# Altium schematic sheet DAP-MCU-3.SchDoc
size D; SheetNumber: 3; SheetTotal: 4
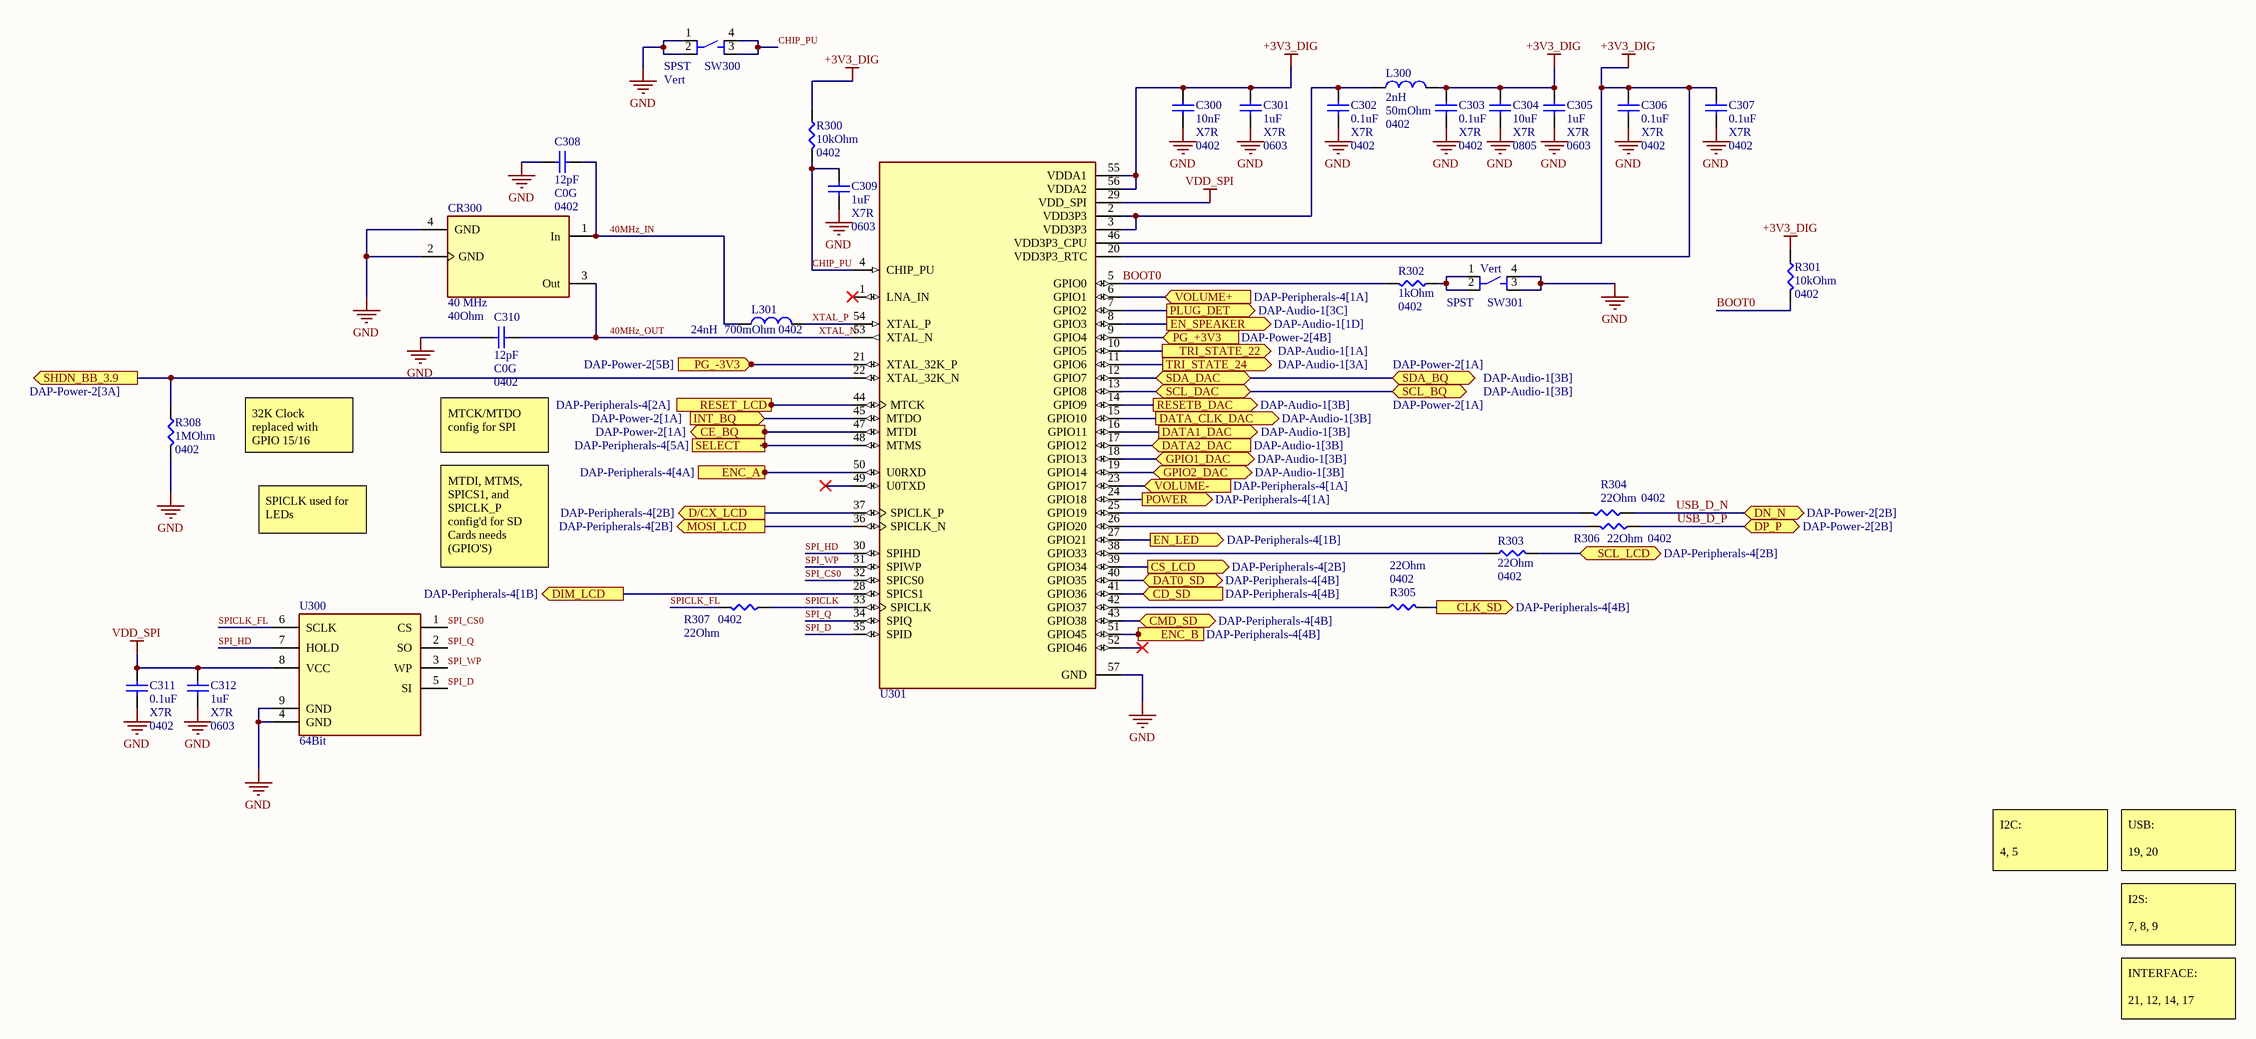
[diagram p0: DAP-MCU-3.SchDoc]

## Parts
C300  <Value>: 10nF  <Spec>: X7R  <Footprint>: 0402  [CAPC1005X55N]  (hidden comment: CAP CER 10000PF 16V X7R 0402)
C301  <Value>: 1uF  <Spec>: X7R  <Footprint>: 0603  [CAPC1608X100N]  (hidden comment: CAP CER 1UF 25V X7R 0603)
C302  <Value>: 0.1uF  <Spec>: X7R  <Footprint>: 0402  [CAPC1005X60N]  (hidden comment: CAP CER 0.1UF 50V X7R 0402)
C303  <Value>: 0.1uF  <Spec>: X7R  <Footprint>: 0402  [CAPC1005X60N]  (hidden comment: CAP CER 0.1UF 50V X7R 0402)
C304  <Value>: 10uF  <Spec>: X7R  <Footprint>: 0805  [CAPC2012X140N]  (hidden comment: CAP CER 10UF 10V X7R 0805)
C305  <Value>: 1uF  <Spec>: X7R  <Footprint>: 0603  [CAPC1608X100N]  (hidden comment: CAP CER 1UF 25V X7R 0603)
C306  <Value>: 0.1uF  <Spec>: X7R  <Footprint>: 0402  [CAPC1005X60N]  (hidden comment: CAP CER 0.1UF 50V X7R 0402)
C307  <Value>: 0.1uF  <Spec>: X7R  <Footprint>: 0402  [CAPC1005X60N]  (hidden comment: CAP CER 0.1UF 50V X7R 0402)
C308  <Value>: 12pF  <Spec>: C0G  <Footprint>: 0402  [CAPC1005X60N]  (hidden comment: CAP CER 12PF 50V C0G/NP0 0402)
C309  <Value>: 1uF  <Spec>: X7R  <Footprint>: 0603  [CAPC1608X100N]  (hidden comment: CAP CER 1UF 25V X7R 0603)
C310  <Value>: 12pF  <Spec>: C0G  <Footprint>: 0402  [CAPC1005X60N]  (hidden comment: CAP CER 12PF 50V C0G/NP0 0402)
C311  <Value>: 0.1uF  <Spec>: X7R  <Footprint>: 0402  [CAPC1005X60N]  (hidden comment: CAP CER 0.1UF 50V X7R 0402)
C312  <Value>: 1uF  <Spec>: X7R  <Footprint>: 0603  [CAPC1608X100N]  (hidden comment: CAP CER 1UF 25V X7R 0603)
CR300  <Value>: 40 MHz  <Spec>: 40Ohm  [CRYST_ECS-400]  (hidden comment: CRYSTAL 40.0000MHZ 10PF SMD)
L300  <Value>: 2nH  <Spec>: 50mOhm  <Footprint>: 0402  [IND_MHQ100507]  (hidden comment: FIXED IND 2NH 1A 50 MOHM SMD)
L301  <Value>: 24nH  <Spec>: 700mOhm  <Footprint>: 0402  [IND_MHQ100507]  (hidden comment: FIXED IND 24NH 250MA 700 MOHM)
R300  <Value>: 10kOhm  <Footprint>: 0402  [RESC1005X40N]  (hidden comment: RES SMD 10K OHM 1% 1/16W 0402)
R301  <Value>: 10kOhm  <Footprint>: 0402  [RESC1005X40N]  (hidden comment: RES SMD 10K OHM 1% 1/16W 0402)
R302  <Value>: 1kOhm  <Footprint>: 0402  [RESC1005X40N]  (hidden comment: RES SMD 1K OHM 0.1% 1/16W 0402)
R303  <Value>: 22Ohm  <Footprint>: 0402  [RESC1005X40N]  (hidden comment: RES 22 OHM 1% 1/16W 0402)
R304  <Value>: 22Ohm  <Footprint>: 0402  [RESC1005X40N]  (hidden comment: RES 22 OHM 1% 1/16W 0402)
R305  <Value>: 22Ohm  <Footprint>: 0402  [RESC1005X40N]  (hidden comment: RES 22 OHM 1% 1/16W 0402)
R306  <Value>: 22Ohm  <Footprint>: 0402  [RESC1005X40N]  (hidden comment: RES 22 OHM 1% 1/16W 0402)
R307  <Value>: 22Ohm  <Footprint>: 0402  [RESC1005X40N]  (hidden comment: RES 22 OHM 1% 1/16W 0402)
R308  <Value>: 1MOhm  <Footprint>: 0402  [RESC1005X40N]  (hidden comment: RES SMD 1M OHM 0.1% 1/16W 0402)
SW300  <Value>: SPST  <Footprint>: Vert  [SW_PTS810_SJM_250_SMTR_LFS]  (hidden comment: SWITCH TACTILE SPST-NO 0.05A 16V)
SW301  <Value>: SPST  <Footprint>: Vert  [SW_PTS810_SJM_250_SMTR_LFS]  (hidden comment: SWITCH TACTILE SPST-NO 0.05A 16V)
U300  <Value>: 64Bit  [SON127P600X500X80-9N]  (hidden comment: IC FLASH 64MBIT SPI/QUAD 8WSON)
U301  ESP32-S3  [IC_ESP32-S3]  (value not drawn)

## Ports
CD_SD (in, see DAP-Peripherals-4[4B]), CE_BQ (out, see DAP-Power-2[1A]), CLK_SD (out, see DAP-Peripherals-4[4B]), CMD_SD (bidir, see DAP-Peripherals-4[4B]), CS_LCD (out, see DAP-Peripherals-4[2B]), D/CX_LCD (out, see DAP-Peripherals-4[2B]), DAT0_SD (bidir, see DAP-Peripherals-4[4B]), DATA1_DAC (out, see DAP-Audio-1[3B]), DATA2_DAC (in, see DAP-Audio-1[3B]), DATA_CLK_DAC (out, see DAP-Audio-1[3B]), DIM_LCD (out, see DAP-Peripherals-4[1B]), DN_N (bidir, see DAP-Power-2[2B]), DP_P (bidir, see DAP-Power-2[2B]), EN_LED (out, see DAP-Peripherals-4[1B]), EN_SPEAKER (out, see DAP-Audio-1[1D]), ENC_A (in, see DAP-Peripherals-4[4A]), ENC_B (in, see DAP-Peripherals-4[4B]), GPIO1_DAC (bidir, see DAP-Audio-1[3B]), GPIO2_DAC (bidir, see DAP-Audio-1[3B]), INT_BQ (in, see DAP-Power-2[1A]), MOSI_LCD (out, see DAP-Peripherals-4[2B]), PG_+3V3 (in, see DAP-Power-2[4B]), PG_-3V3 (in, see DAP-Power-2[5B]), PLUG_DET (out, see DAP-Audio-1[3C]), POWER (out, see DAP-Peripherals-4[1A]), RESET_LCD (out, see DAP-Peripherals-4[2A]), RESETB_DAC (out, see DAP-Audio-1[3B]), SCL_BQ (bidir, see DAP-Power-2[1A]), SCL_DAC (bidir, see DAP-Audio-1[3B]), SCL_LCD (bidir, see DAP-Peripherals-4[2B]), SDA_BQ (bidir, see DAP-Power-2[1A]), SDA_DAC (bidir, see DAP-Audio-1[3B]), SELECT (in, see DAP-Peripherals-4[5A]), SHDN_BB_3.9 (out, see DAP-Power-2[3A]), TRI_STATE_22 (out, see DAP-Audio-1[1A]), TRI_STATE_24 (out, see DAP-Audio-1[3A]), VOLUME+ (in, see DAP-Peripherals-4[1A]), VOLUME- (in, see DAP-Peripherals-4[1A])

## Nets
+3V3_DIG: C300.2 C301.2 C303.2 C304.2 C305.2 C306.2 C307.2 L300.2 R300.2 R301.2 U301.20(VDD3P3_RTC) U301.46(VDD3P3_CPU) U301.55(VDDA1) U301.56(VDDA2)
GND: C300.1 C301.1 C302.1 C303.1 C304.1 C305.1 C306.1 C307.1 C308.2 C309.1 C310.2 C311.1 C312.1 CR300.2(GND) CR300.4(GND) R308.1 SW300.1 SW300.2 SW301.3 SW301.4 U300.4(GND) U300.9(GND) U301.57(GND)
VDD_SPI: C311.2 C312.2 U300.8(VCC) U301.29(VDD_SPI)
40MHz_IN: C308.1 CR300.1(In) L301.1
40MHz_OUT: C310.1 CR300.3(Out) U301.53(XTAL_N)  [also labelled XTAL_N]
BOOT0: R301.1 R302.1 U301.5(GPIO0)
CD_SD: U301.41(GPIO36) ; port CD_SD
CE_BQ: U301.47(MTDI) ; port CE_BQ
CHIP_PU: C309.2 R300.1 SW300.3 SW300.4 U301.4(CHIP_PU)
CLK_SD: R305.1 ; port CLK_SD
CMD_SD: U301.43(GPIO38) ; port CMD_SD
CS_LCD: U301.39(GPIO34) ; port CS_LCD
D/CX_LCD: U301.37(SPICLK_P) ; port D/CX_LCD
DAT0_SD: U301.40(GPIO35) ; port DAT0_SD
DATA1_DAC: U301.16(GPIO11) ; port DATA1_DAC
DATA2_DAC: U301.17(GPIO12) ; port DATA2_DAC
DATA_CLK_DAC: U301.15(GPIO10) ; port DATA_CLK_DAC
DIM_LCD: U301.28(SPICS1) ; port DIM_LCD
EN_LED: U301.27(GPIO21) ; port EN_LED
EN_SPEAKER: U301.8(GPIO3) ; port EN_SPEAKER
ENC_A: U301.50(U0RXD) ; port ENC_A
ENC_B: U301.51(GPIO45) ; port ENC_B
GPIO1_DAC: U301.18(GPIO13) ; port GPIO1_DAC
GPIO2_DAC: U301.19(GPIO14) ; port GPIO2_DAC
INT_BQ: U301.45(MTDO) ; port INT_BQ
MOSI_LCD: U301.36(SPICLK_N) ; port MOSI_LCD
PG_+3V3: U301.9(GPIO4) ; port PG_+3V3
PG_-3V3: U301.21(XTAL_32K_P) ; port PG_-3V3
PLUG_DET: U301.7(GPIO2) ; port PLUG_DET
POWER: U301.24(GPIO18) ; port POWER
RESET_LCD: U301.44(MTCK) ; port RESET_LCD
RESETB_DAC: U301.14(GPIO9) ; port RESETB_DAC
SCL_BQ: U301.13(GPIO8) ; port SCL_DAC, port SCL_BQ
SCL_LCD: R303.1 ; port SCL_LCD
SDA_BQ: U301.12(GPIO7) ; port SDA_DAC, port SDA_BQ
SELECT: U301.48(MTMS) ; port SELECT
SHDN_BB_3.9: R308.2 U301.22(XTAL_32K_N) ; port SHDN_BB_3.9
SPI_CS0: U300.1(CS) U301.32(SPICS0)
SPI_D: U300.5(SI) U301.35(SPID)
SPI_HD: U300.7(HOLD) U301.30(SPIHD)
SPI_Q: U300.2(SO) U301.34(SPIQ)
SPI_WP: U300.3(WP) U301.31(SPIWP)
SPICLK: R307.2 U301.33(SPICLK)
SPICLK_FL: R307.1 U300.6(SCLK)
TRI_STATE_22: U301.10(GPIO5) ; port TRI_STATE_22
TRI_STATE_24: U301.11(GPIO6) ; port TRI_STATE_24
USB_D_N: R304.2 ; port DN_N
USB_D_P: R306.2 ; port DP_P
VOLUME+: U301.6(GPIO1) ; port VOLUME+
VOLUME-: U301.23(GPIO17) ; port VOLUME-
XTAL_P: L301.2 U301.54(XTAL_P)
NetC302_2: C302.2 L300.1 U301.2(VDD3P3) U301.3(VDD3P3)
NetR302_2: R302.2 SW301.1 SW301.2
NetR303_2: R303.2 U301.38(GPIO33)
NetR304_1: R304.1 U301.25(GPIO19)
NetR305_2: R305.2 U301.42(GPIO37)
NetR306_1: R306.1 U301.26(GPIO20)

Not connected (* = marked no-connect by the designer): U301 1(LNA_IN)* 49(U0TXD)* 52(GPIO46)*

## Notes on the sheet
- 32K Clock replaced with GPIO 15/16
- MTCK/MTDO config for SPI
- SPICLK used for LEDs
- MTDI, MTMS, SPICS1, and SPICLK_P config'd for SD Cards needs (GPIO'S)
- I2C:
  4, 5
- USB:
  19, 20
- I2S:
  7, 8, 9
- INTERFACE:
  21, 12, 14, 17

## Library data of the parts
C300 = #1-040: Manufacturer 1: YAGEO; Manufacturer Part Number 1: CC0402KRX7R7BB103; AL-PN: #1-040; SubType: Ceramic; <Tolerance>: 0.1; <Termination>: SMD; Creator Project: aRTy; Type: Standard; Lead Time: 21 Weeks; PartType: Capacitor; <Rating>: 16V; Status: Verified; Supplier 1: Digikey; Supplier Label: 10000 pF ±10% 16V Ceramic Capacitor X7R 0402 (1005 Metric); Supplier Part Number 1: 311-1042-2-ND
C301 C305 C309 C312 = #1-132: Manufacturer 1: Murata Electronics; Manufacturer Part Number 1: GCM188R71E105KA64D; AL-PN: #1-132; SubType: Ceramic; <Tolerance>: 0.1; <Termination>: SMD; Creator Project: DAP; Type: Standard; Lead Time: 21 Weeks; PartType: Capacitor; <Rating>: 25V; Status: Verified; Supplier 1: Digikey; Supplier Label: 1 µF ±10% 25V Ceramic Capacitor X7R 0603 (1608 Metric); Supplier Part Number 1: 490-10673-1-ND
C302 C303 C306 C307 C311 = #1-080: Manufacturer 1: Murata Electronics; Manufacturer Part Number 1: GCM155R71H104KE02D; AL-PN: #1-080; SubType: Ceramic; <Tolerance>: 0.1; <Termination>: SMD; Creator Project: DAP; Type: Standard; Lead Time: 21 Weeks; PartType: Capacitor; <Rating>: 50V; Status: Verified; Supplier 1: Digikey; Supplier Label: 0.1 µF ±10% 50V Ceramic Capacitor X7R 0402 (1005 Metric); Supplier Part Number 1: 490-10672-1-ND
C304 = #1-081: Manufacturer 1: Murata Electronics; Manufacturer Part Number 1: GCM21BR71A106KE22K; AL-PN: #1-081; SubType: Ceramic; <Tolerance>: 0.1; <Termination>: SMD; Creator Project: DAP; Type: Standard; Lead Time: 21 Weeks; PartType: Capacitor; <Rating>: 10V; Status: Verified; Supplier 1: Digikey; Supplier Label: 10 µF ±10% 10V Ceramic Capacitor X7R 0805 (2012 Metric); Supplier Part Number 1: 490-14531-1-ND
C308 C310 = #1-122: Manufacturer 1: Murata Electronics; Manufacturer Part Number 1: GJM1555C1H120FB01D; AL-PN: #1-122; SubType: Ceramic; <Tolerance>: 0.01; <Termination>: SMD; Creator Project: DAP; Type: Standard; Lead Time: 17 Weeks; PartType: Capacitor; <Rating>: 50V; Status: Verified; Supplier 1: Digikey; Supplier Label: 12 pF ±1% 50V Ceramic Capacitor C0G, NP0 0402 (1005 Metric); Supplier Part Number 1: 490-11190-1-ND
CR300 = #1-118: Manufacturer 1: ECS Inc.; Manufacturer Part Number 1: ECS-400-10-37B2-CKY-TR; AL-PN: #1-118; Creator Project: DAP; Type: Standard; PartType: Crystal; <Rating>: 10pF; <Termination>: SMD; Status: Verified; Supplier 1: Digikey; Supplier Label: 40 MHz ±10ppm Crystal 12pF 40 Ohms 4-SMD, No Lead; Supplier Part Number 1: 50-ECS-400-10-37B2-CKY-TRCT-ND; Lead Time: N/A
L300 = #1-121: Manufacturer 1: TDK; Manufacturer Part Number 1: MHQ1005075HA2N0BTD25; AL-PN: #1-121; SubType: Shielded; Creator Project: DAP; Type: Standard; Lead Time: 12 Weeks; PartType: Inductor; <Rating>: 1A; <Termination>: SMD; Status: Verified; Supplier 1: Digikey; Supplier Label: 2 nH Shielded Multilayer Inductor 1 A 50mOhm Max 0402 (1005 Metric); Supplier Part Number 1: 445-MHQ1005075HA2N0BTD25CT-ND
L301 = #1-120: Manufacturer 1: TDK; Manufacturer Part Number 1: MHQ1005075HA24NHTD25; AL-PN: #1-120; SubType: Shielded; <Tolerance>: 0.03; <Termination>: SMD; Creator Project: DAP; Type: Standard; Lead Time: 12 Weeks; PartType: Inductor; <Rating>: 250mA; Status: Verified; Supplier 1: Digikey; Supplier Label: 24 nH Shielded Multilayer Inductor 250 mA 700mOhm Max 0402 (1005 Metric); Supplier Part Number 1: 445-MHQ1005075HA24NHTD25CT-ND
R300 R301 = #1-134: Manufacturer 1: YAGEO; Manufacturer Part Number 1: AC0402FR-0710KL; AL-PN: #1-134; <Tolerance>: 0.01; Creator Project: DAP; Lead Time: 22 Weeks; PartType: Resistor; <Termination>: SMD; Status: Verified; Supplier 1: Digikey; Supplier Label: 10 kOhms ±1% 0.063W, 1/16W Chip Resistor 0402 (1005 Metric) Automotive AEC-Q200, Moisture Resistant Thick Film; Supplier Part Number 1: YAG3436CT-ND; Type: Standard
R302 = #1-043: Manufacturer 1: YAGEO; Manufacturer Part Number 1: RT0402BRD071KL; AL-PN: #1-043; <Tolerance>: 0.001; Creator Project: aRTy; Lead Time: 20 Weeks; PartType: Resistor; <Rating>: 1/16W; <Termination>: SMD; Status: Verified; Supplier 1: Digikey; Supplier Label: 1 kOhms ±0.1% 0.063W, 1/16W Chip Resistor 0402 (1005 Metric) Thin Film; Supplier Part Number 1: YAG1386TR-ND; Type: Standard
R303-R307 = #1-102: Manufacturer 1: YAGEO; Manufacturer Part Number 1: RC0402FR-0722RL; AL-PN: #1-102; <Tolerance>: 0.01; <Termination>: SMD; Creator Project: DAP; Lead Time: 22 Weeks; PartType: Resistor; <Rating>: 1/16W; Status: Verified; Supplier 1: Digikey; Supplier Label: 22 Ohms ±1% 0.063W, 1/16W Chip Resistor 0402 (1005 Metric) Moisture Resistant Thick Film; Supplier Part Number 1: 311-22.0LRCT-ND; Type: Standard
R308 = #1-123: Manufacturer 1: YAGEO; Manufacturer Part Number 1: RE0402BRE071ML; AL-PN: #1-123; <Tolerance>: 0.001; Creator Project: DAP; Lead Time: 20 Weeks; PartType: Resistor; <Rating>: 1/16W; <Termination>: SMD; Status: Verified; Supplier 1: Digikey; Supplier Label: 1 MOhms ±0.1% 0.063W, 1/16W Chip Resistor 0402 (1005 Metric) Thick Film; Supplier Part Number 1: 13-RE0402BRE071MLCT-ND; Type: Standard
SW300 SW301 = #1-115: Manufacturer Part Number 1: PTS810SJM250SMTR LFS; MF: C&K; MP: PTS810 SJM 250 SMTR LFS; AL-PN: #1-115; SubType: Tacticle; <Termination>: SMD; Creator Project: DAP; Lead Time: 16 Weeks; SnapEDA_Link: https://www.snapeda.com/parts/PTS810%20SJM%20250%20SMTR%20LFS/C%2526K/view-part/?ref=snap; Package: None; Value: *; Check_prices: https://www.snapeda.com/parts/PTS810%20SJM%20250%20SMTR%20LFS/C%2526K/view-part/?ref=eda; PartType: Switch; Status: Verified; Supplier 1: Digikey; Supplier Label: Tactile Switch SPST-NO Top Actuated Surface Mount; Supplier Part Number 1: CKN10502CT-ND; Type: Standard; Manufacturer 1: C&K
U300 = #1-124: Manufacturer 1: Gigadevice Electronics Singapore PTE.LTD.; Manufacturer Part Number 1: GD25B64EWIGR; AL-PN: #1-124; <Rating>: 133MHz; <Termination>: SMD; Creator Project: DAP; PartType: IC; SubType: FLASH; Status: Verified; Supplier 1: Digikey; Supplier Label: FLASH - NOR (SLC) Memory IC 64Mbit SPI - Quad I/O 133 MHz 7 ns 8-WSON (5x6); Supplier Part Number 1: 1970-GD25B64EWIGRCT-ND; Type: Standard; Lead Time: N/A
U301 = #1-055: Manufacturer 1: Espressif Technologies; MF: Espressif Systems; AL-PN: #1-055; SubType: ESP-32; <Termination>: SMD; Creator Project: DAP; Lead Time: 8 Weeks; Check_prices: https://www.snapeda.com/parts/ESP32-S3/Espressif+Systems/view-part/?ref=eda; Purchase-URL: https://pricing.snapeda.com/search/part/ESP32-S3/?ref=eda; Value: *; Availability: In Stock; Package: None; SnapEDA_Link: https://www.snapeda.com/parts/ESP32-S3/Espressif+Systems/view-part/?ref=snap; MP: ESP32-S3; Price: None; PartType: MCU; Status: Verified; Supplier 1: Digikey; Supplier Label: IC RF TxRx + MCU Bluetooth, WiFi 802.11b/g/n, Bluetooth v5.0 2.412GHz ~ 2.484GHz 56-VFQFN Exposed Pad; Supplier Part Number 1: 1965-ESP32-S3-ND; Type: Standard; Manufacturer Part Number 1: ESP32-S3